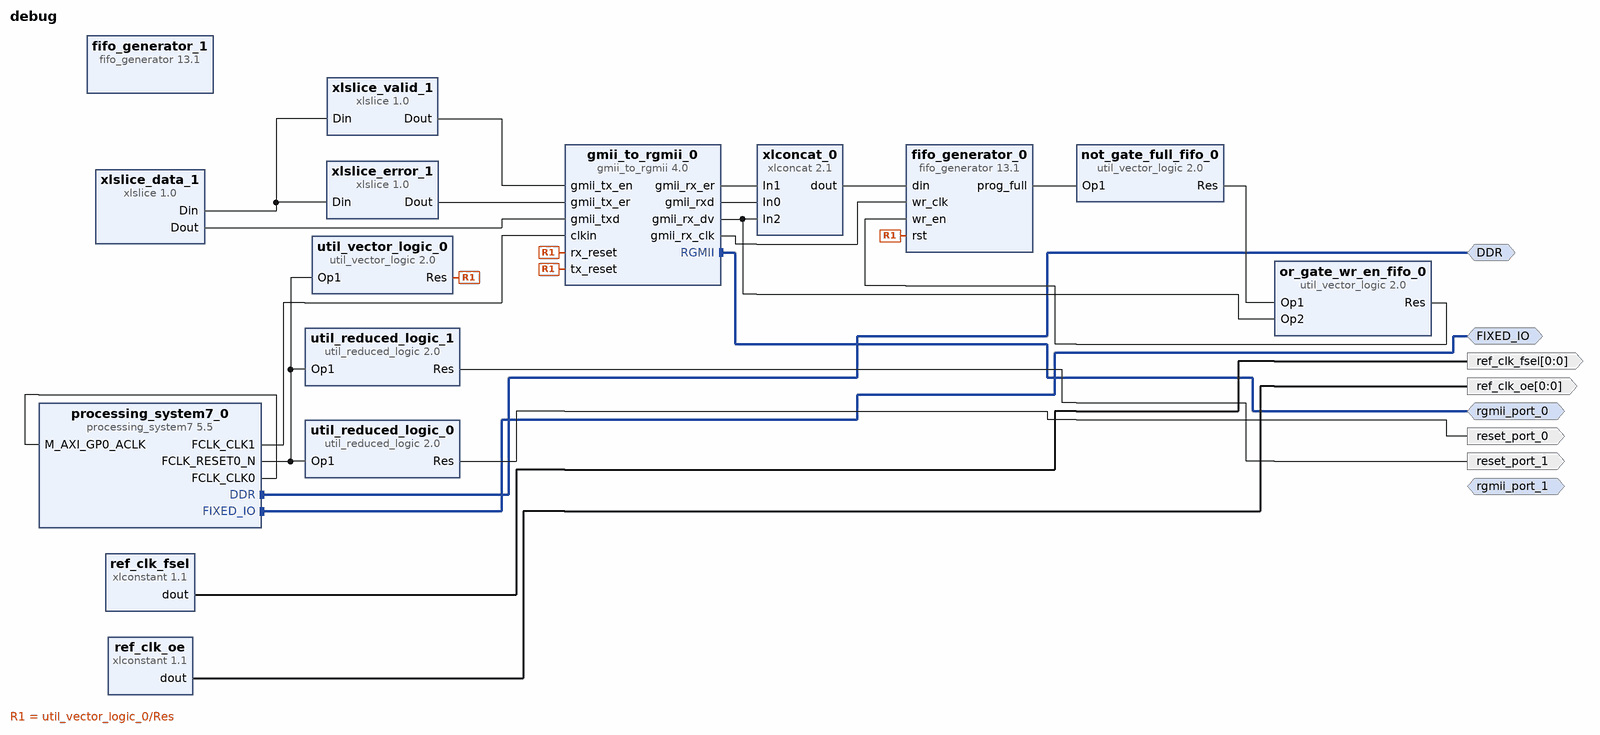
[diagram p0: block diagram of the top level]
# Vivado block design debug, Vivado 2016.2
create_bd_design debug

create_bd_intf_port -mode Master -vlnv xilinx.com:interface:ddrx_rtl:1.0 DDR
create_bd_intf_port -mode Master -vlnv xilinx.com:display_processing_system7:fixedio_rtl:1.0 FIXED_IO
create_bd_intf_port -mode Master -vlnv xilinx.com:interface:rgmii_rtl:1.0 rgmii_port_0
create_bd_intf_port -mode Master -vlnv xilinx.com:interface:rgmii_rtl:1.0 rgmii_port_1
create_bd_port -dir O -from 0 -to 0 ref_clk_fsel
create_bd_port -dir O -from 0 -to 0 ref_clk_oe
create_bd_port -dir O reset_port_0
create_bd_port -dir O reset_port_1

create_bd_cell -type ip -vlnv xilinx.com:ip:fifo_generator:13.1 fifo_generator_0
set_property -dict [list \
  CONFIG.Fifo_Implementation Independent_Clocks_Block_RAM \
  CONFIG.Input_Data_Width 10 \
  CONFIG.Output_Data_Width 10 \
  CONFIG.Full_Flags_Reset_Value 1 \
  CONFIG.Valid_Flag true \
  CONFIG.Write_Acknowledge_Flag false \
  CONFIG.Write_Data_Count true \
  CONFIG.Write_Data_Count_Width 10 \
  CONFIG.Read_Data_Count true \
  CONFIG.Programmable_Full_Type Single_Programmable_Full_Threshold_Constant \
  CONFIG.Full_Threshold_Assert_Value 600 \
  CONFIG.Programmable_Empty_Type Single_Programmable_Empty_Threshold_Constant \
  CONFIG.Empty_Threshold_Assert_Value 400 \
] [get_bd_cells fifo_generator_0]
create_bd_cell -type ip -vlnv xilinx.com:ip:gmii_to_rgmii:4.0 gmii_to_rgmii_0
set_property -dict {CONFIG.C_PHYADDR 7 CONFIG.SupportLevel Include_Shared_Logic_in_Core} [get_bd_cells gmii_to_rgmii_0]
create_bd_cell -type ip -vlnv xilinx.com:ip:util_vector_logic:2.0 not_gate_full_fifo_0
set_property -dict {CONFIG.C_SIZE 1 CONFIG.C_OPERATION not} [get_bd_cells not_gate_full_fifo_0]
create_bd_cell -type ip -vlnv xilinx.com:ip:util_vector_logic:2.0 or_gate_wr_en_fifo_0
set_property -dict {CONFIG.C_SIZE 1 CONFIG.C_OPERATION or} [get_bd_cells or_gate_wr_en_fifo_0]
create_bd_cell -type ip -vlnv xilinx.com:ip:processing_system7:5.5 processing_system7_0
set_property -dict [list \
  CONFIG.PCW_FPGA1_PERIPHERAL_FREQMHZ 200 \
  CONFIG.PCW_EN_CLK1_PORT 1 \
  CONFIG.PCW_QSPI_GRP_SINGLE_SS_ENABLE 1 \
  CONFIG.PCW_ENET1_PERIPHERAL_ENABLE 1 \
  CONFIG.preset ZedBoard \
] [get_bd_cells processing_system7_0]
create_bd_cell -type ip -vlnv xilinx.com:ip:xlconstant:1.1 ref_clk_fsel
create_bd_cell -type ip -vlnv xilinx.com:ip:xlconstant:1.1 ref_clk_oe
create_bd_cell -type ip -vlnv xilinx.com:ip:util_reduced_logic:2.0 util_reduced_logic_0
set_property -dict {CONFIG.C_SIZE 1} [get_bd_cells util_reduced_logic_0]
create_bd_cell -type ip -vlnv xilinx.com:ip:util_reduced_logic:2.0 util_reduced_logic_1
set_property -dict {CONFIG.C_SIZE 1} [get_bd_cells util_reduced_logic_1]
create_bd_cell -type ip -vlnv xilinx.com:ip:util_vector_logic:2.0 util_vector_logic_0
set_property -dict {CONFIG.C_SIZE 1 CONFIG.C_OPERATION not} [get_bd_cells util_vector_logic_0]
create_bd_cell -type ip -vlnv xilinx.com:ip:xlconcat:2.1 xlconcat_0
set_property -dict {CONFIG.NUM_PORTS 3 CONFIG.IN0_WIDTH 8 CONFIG.IN1_WIDTH 1} [get_bd_cells xlconcat_0]
create_bd_cell -type ip -vlnv xilinx.com:ip:xlslice:1.0 xlslice_data_1
set_property -dict {CONFIG.DOUT_WIDTH 8 CONFIG.DIN_TO 0 CONFIG.DIN_FROM 7 CONFIG.DIN_WIDTH 16} [get_bd_cells xlslice_data_1]
create_bd_cell -type ip -vlnv xilinx.com:ip:xlslice:1.0 xlslice_error_1
set_property -dict {CONFIG.DOUT_WIDTH 1 CONFIG.DIN_TO 8 CONFIG.DIN_FROM 8 CONFIG.DIN_WIDTH 16} [get_bd_cells xlslice_error_1]
create_bd_cell -type ip -vlnv xilinx.com:ip:xlslice:1.0 xlslice_valid_1
set_property -dict {CONFIG.DOUT_WIDTH 1 CONFIG.DIN_TO 9 CONFIG.DIN_FROM 9 CONFIG.DIN_WIDTH 16} [get_bd_cells xlslice_valid_1]
create_bd_cell -type ip -vlnv xilinx.com:ip:fifo_generator:13.1 fifo_generator_1
set_property -dict [list \
  CONFIG.Fifo_Implementation Independent_Clocks_Block_RAM \
  CONFIG.INTERFACE_TYPE AXI_STREAM \
  CONFIG.Input_Data_Width 10 \
  CONFIG.Output_Data_Width 10 \
  CONFIG.Full_Flags_Reset_Value 1 \
  CONFIG.Valid_Flag true \
  CONFIG.Write_Acknowledge_Flag false \
  CONFIG.Programmable_Full_Type No_Programmable_Full_Threshold \
  CONFIG.Programmable_Empty_Type No_Programmable_Empty_Threshold \
  CONFIG.Clock_Type_AXI Independent_Clock \
  CONFIG.FIFO_Implementation_wach Independent_Clocks_Distributed_RAM \
  CONFIG.FIFO_Implementation_wdch Independent_Clocks_Block_RAM \
  CONFIG.FIFO_Implementation_wrch Independent_Clocks_Distributed_RAM \
  CONFIG.FIFO_Implementation_rach Independent_Clocks_Distributed_RAM \
  CONFIG.FIFO_Implementation_rdch Independent_Clocks_Block_RAM \
  CONFIG.FIFO_Implementation_axis Independent_Clocks_Block_RAM \
  CONFIG.Enable_Data_Counts_axis true \
  CONFIG.Programmable_Full_Type_axis Single_Programmable_Full_Threshold_Constant \
  CONFIG.Full_Threshold_Assert_Value_axis 600 \
  CONFIG.Programmable_Empty_Type_axis Single_Programmable_Empty_Threshold_Constant \
  CONFIG.Empty_Threshold_Assert_Value_axis 400 \
] [get_bd_cells fifo_generator_1]

# ---- connections ----

connect_bd_intf_net [get_bd_intf_ports DDR] [get_bd_intf_pins processing_system7_0/DDR]
connect_bd_intf_net [get_bd_intf_ports FIXED_IO] [get_bd_intf_pins processing_system7_0/FIXED_IO]
connect_bd_intf_net [get_bd_intf_ports rgmii_port_0] [get_bd_intf_pins gmii_to_rgmii_0/RGMII]
connect_bd_net [get_bd_pins fifo_generator_0/prog_full] [get_bd_pins not_gate_full_fifo_0/Op1]
connect_bd_net -net fifo_generator_1_dout [get_bd_pins xlslice_data_1/Din] [get_bd_pins xlslice_error_1/Din] [get_bd_pins xlslice_valid_1/Din]
connect_bd_net [get_bd_pins gmii_to_rgmii_0/gmii_rx_clk] [get_bd_pins fifo_generator_0/wr_clk]
connect_bd_net [get_bd_pins gmii_to_rgmii_0/gmii_rx_dv] [get_bd_pins xlconcat_0/In2] [get_bd_pins or_gate_wr_en_fifo_0/Op2]
connect_bd_net [get_bd_pins gmii_to_rgmii_0/gmii_rx_er] [get_bd_pins xlconcat_0/In1]
connect_bd_net [get_bd_pins gmii_to_rgmii_0/gmii_rxd] [get_bd_pins xlconcat_0/In0]
connect_bd_net [get_bd_pins not_gate_full_fifo_0/Res] [get_bd_pins or_gate_wr_en_fifo_0/Op1]
connect_bd_net [get_bd_pins or_gate_wr_en_fifo_0/Res] [get_bd_pins fifo_generator_0/wr_en]
connect_bd_net [get_bd_pins processing_system7_0/FCLK_CLK0] [get_bd_pins processing_system7_0/M_AXI_GP0_ACLK]
connect_bd_net [get_bd_pins processing_system7_0/FCLK_CLK1] [get_bd_pins gmii_to_rgmii_0/clkin]
connect_bd_net [get_bd_pins processing_system7_0/FCLK_RESET0_N] \
  [get_bd_pins util_vector_logic_0/Op1] [get_bd_pins util_reduced_logic_0/Op1] [get_bd_pins util_reduced_logic_1/Op1]
connect_bd_net [get_bd_pins ref_clk_fsel/dout] [get_bd_ports ref_clk_fsel]
connect_bd_net [get_bd_pins ref_clk_oe/dout] [get_bd_ports ref_clk_oe]
connect_bd_net [get_bd_pins util_reduced_logic_0/Res] [get_bd_ports reset_port_0]
connect_bd_net [get_bd_pins util_reduced_logic_1/Res] [get_bd_ports reset_port_1]
connect_bd_net [get_bd_pins util_vector_logic_0/Res] \
  [get_bd_pins gmii_to_rgmii_0/tx_reset] [get_bd_pins gmii_to_rgmii_0/rx_reset] [get_bd_pins fifo_generator_0/rst]
connect_bd_net [get_bd_pins xlconcat_0/dout] [get_bd_pins fifo_generator_0/din]
connect_bd_net [get_bd_pins xlslice_data_1/Dout] [get_bd_pins gmii_to_rgmii_0/gmii_txd]
connect_bd_net [get_bd_pins xlslice_error_1/Dout] [get_bd_pins gmii_to_rgmii_0/gmii_tx_er]
connect_bd_net [get_bd_pins xlslice_valid_1/Dout] [get_bd_pins gmii_to_rgmii_0/gmii_tx_en]

validate_bd_design
save_bd_design
